# EAGLE design TempGuard (EAGLE 5.10)
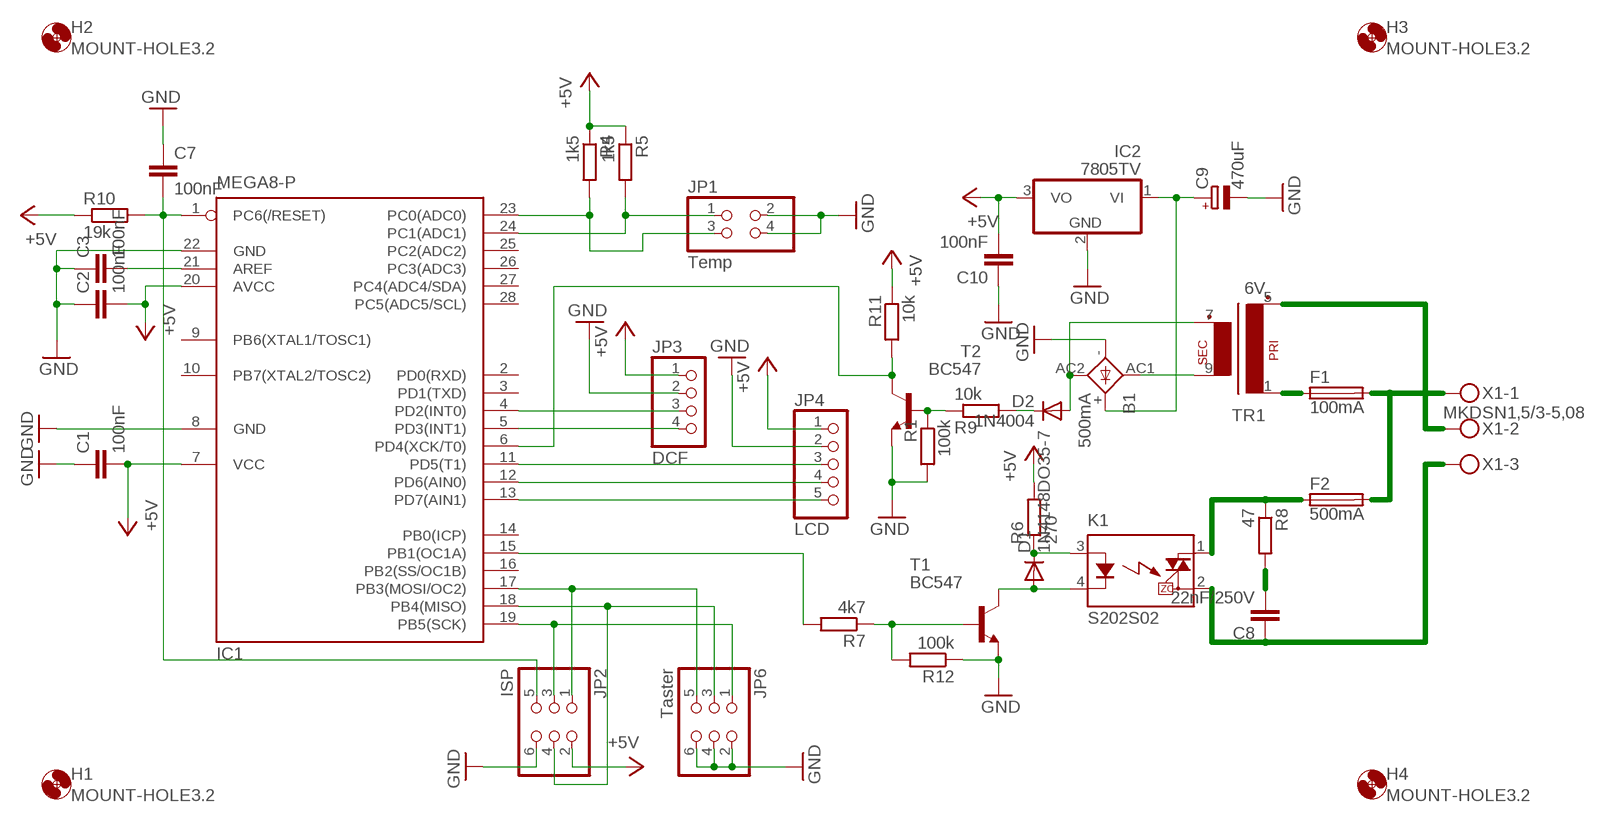
[diagram p0: schematic, sheet 1]

## Parts
B1  500mA  2KBB-R  [2KBB-R]
C1  100nF  C-EU025-025X050  [C025-025X050]
C2  100nF  C-EU025-025X050  [C025-025X050]
C3  100nF  C-EU025-025X050  [C025-025X050]
C7  100nF  C-EU025-025X050  [C025-025X050]
C8  22nF/250V  C-EU075-032X103  [C075-032X103]
C9  470uF  CPOL-EUE5-10.5  [E5-10,5]
C10  100nF  C-EU050-025X075  [C050-025X075]
D1  1N4148DO35-7  [DO35-7]
D2  1N4004  [DO41-10]
F1  100mA  SH22  [SH22]
F2  500mA  SH22  [SH22]
H1  MOUNT-HOLE3.2  [3,2]
H2  MOUNT-HOLE3.2  [3,2]
H3  MOUNT-HOLE3.2  [3,2]
H4  MOUNT-HOLE3.2  [3,2]
IC1  MEGA8-P  [DIL28-3]
IC2  7805TV  [TO220V]
JP1  Temp  PINHD-2X2  [2X02]
JP2  ISP  PINHD-2X3  [2X03]
JP3  DCF  PINHD-1X4  [1X04]
JP4  LCD  PINHD-1X5  [1X05]
JP6  Taster  PINHD-2X3  [2X03]
K1  S202S02  [S202S02]
R1  100k  R-EU_0204/7  [0204/7]
R4  1k5  R-EU_0204/7  [0204/7]
R5  1k5  R-EU_0204/7  [0204/7]
R6  270  R-EU_0204/7  [0204/7]
R7  4k7  R-EU_0204/7  [0204/7]
R8  47  R-EU_0207/10  [0207/10]
R9  10k  R-EU_0204/7  [0204/7]
R10  19k  R-EU_0204/7  [0204/7]
R11  10k  R-EU_0204/7  [0204/7]
R12  100k  R-EU_0204/7  [0204/7]
T1  BC547  [TO92]
T2  BC547  [TO92]
TR1  6V  EI30-1  [EI30-1]
X1  MKDSN1,5/3-5,08  [MKDSN1,5/3-5,08]

## Nets
+5V: C1.2 C2.2 C10.2 IC1.7(VCC) IC1.20(AVCC) IC2.3(VO) JP2.2 JP3.1 JP4.1 R4.1 R5.1 R6.2 R10.1 R11.1
GND: B1.- C1.1 C2.1 C3.1 C7.1 C9.- C10.1 IC1.8(GND) IC1.22(GND) IC2.2(GND) JP1.2 JP1.4 JP2.6 JP3.2 JP4.2 JP6.2 JP6.4 JP6.6 R1.2 R12.1 T1.1(E) T2.1(E)
N$1: C3.2 IC1.21(AREF)
N$2: IC1.5(PD3(INT1)) JP3.4
N$3: C7.2 IC1.1(PC6(/RESET)) JP2.5 R10.2
N$4: IC1.23(PC0(ADC0)) JP1.3 R4.2
N$5: IC1.24(PC1(ADC1)) JP1.1 R5.2
N$6: IC1.17(PB3(MOSI/OC2)) JP2.1 JP6.5
N$7: IC1.18(PB4(MISO)) JP2.4 JP6.3
N$8: IC1.19(PB5(SCK)) JP2.3 JP6.1
N$9: IC1.4(PD2(INT0)) JP3.3
N$10: IC1.13(PD7(AIN1)) JP4.5
N$11: IC1.11(PD5(T1)) JP4.3
N$12: IC1.12(PD6(AIN0)) JP4.4
N$13: D1.C K1.3(A) R6.1
N$14: D1.A K1.4(K) T1.3(C)
N$15: IC1.15(PB1(OC1A)) R7.2
N$16: R7.1 R12.2 T1.2(B)
N$17: C8.2 R8.2
N$18: C8.1 K1.2(DS2) X1.3
N$19: F2.1 K1.1(DS1) R8.1
N$20: F1.1 TR1.1
N$21: F1.2 F2.2 X1.1
N$22: B1.AC1 TR1.9(S4)
N$23: TR1.5(P2) X1.2
N$24: B1.AC2 D2.A TR1.7(S3)
N$25: B1.+ C9.+ IC2.1(VI)
N$26: D2.C R9.2
N$27: R1.1 R9.1 T2.2(B)
N$28: IC1.6(PD4(XCK/T0)) R11.2 T2.3(C)
Unconnected: IC1.2(PD0(RXD)) IC1.3(PD1(TXD)) IC1.9(PB6(XTAL1/TOSC1)) IC1.10(PB7(XTAL2/TOSC2)) IC1.14(PB0(ICP)) IC1.16(PB2(SS/OC1B)) IC1.25(PC2(ADC2)) IC1.26(PC3(ADC3)) IC1.27(PC4(ADC4/SDA)) IC1.28(PC5(ADC5/SCL))

## Library data of the parts
B1 = rectifier:2KBB-R: RECTIFIER grid 3 x 5 mm
C1-C3 C7 C8 C10 = rcl:C-EU: CAPACITOR, European symbol
C9 = resistor:CPOL-EU: POLARIZED CAPACITOR, European symbol
D1 = diode:1N4148: DIODE high speed (Philips)
D2 = diode:1N4004: DIODE general purpose rectifier, 1 A
F1 F2 = fuse:SH22: FUSE HOLDER CS PFP30, Schukat
H1-H4 = holes:MOUNT-HOLE: MOUNTING HOLE with drill center marker
IC1 = atmel:MEGA8-P: MICROCONTROLLER 8 Kbytes FLASH, 1 kbytes SRAM, 512 bytes EEPROM, USART, 4-channel 10 bit ADC, 2-channel 8 bit ADC Pin compatible with Atmega48, ATMega88, ATMega168 Source: avr.lbr
IC2 = linear:78*: Positive VOLTAGE REGULATOR Source: http://cache.national.com/ds/LM/LM78L05.pdf http://www.fairchildsemi.com/ds/LM/LM7805.pdf
JP1 = pinhead:PINHD-2X2: PIN HEADER
JP2 JP6 = pinhead:PINHD-2X3: PIN HEADER
JP3 = pinhead:PINHD-1X4: PIN HEADER
JP4 = pinhead:PINHD-1X5: PIN HEADER
K1 = relay:S*02S02: IT(rms) 8A, Zero Cross type SIP 4pin Triac output SSR Source: http://sharp-world.com/products/device/lineup/data/pdf/datasheet/s102s02_e.pdf
R1 R4-R12 = rcl:R-EU_: RESISTOR, European symbol
T1 T2 = transistor:BC547: NPN TRANSISTOR
TR1 = trafo:EI30-1: TRANSFORMER 1 primary winding, 1 secondary winding ERA
X1 = con-phoenix-508:MKDSN1,5/3-5,08: MKDSN 1,5/ 3-5,08 Printklemme Nennstrom: 13,5 A Nennspannung: 250 V Rastermaß: 5,08 mm Polzahl: 3 Anschlussart: Schraubanschluss Montage: Löten Anschlussrichtung Leiter/Platine: 0 ° Artikelnummer: 1729131 Source: http://eshop.phoenixcontact.com .. 1729131.pdf

## Board
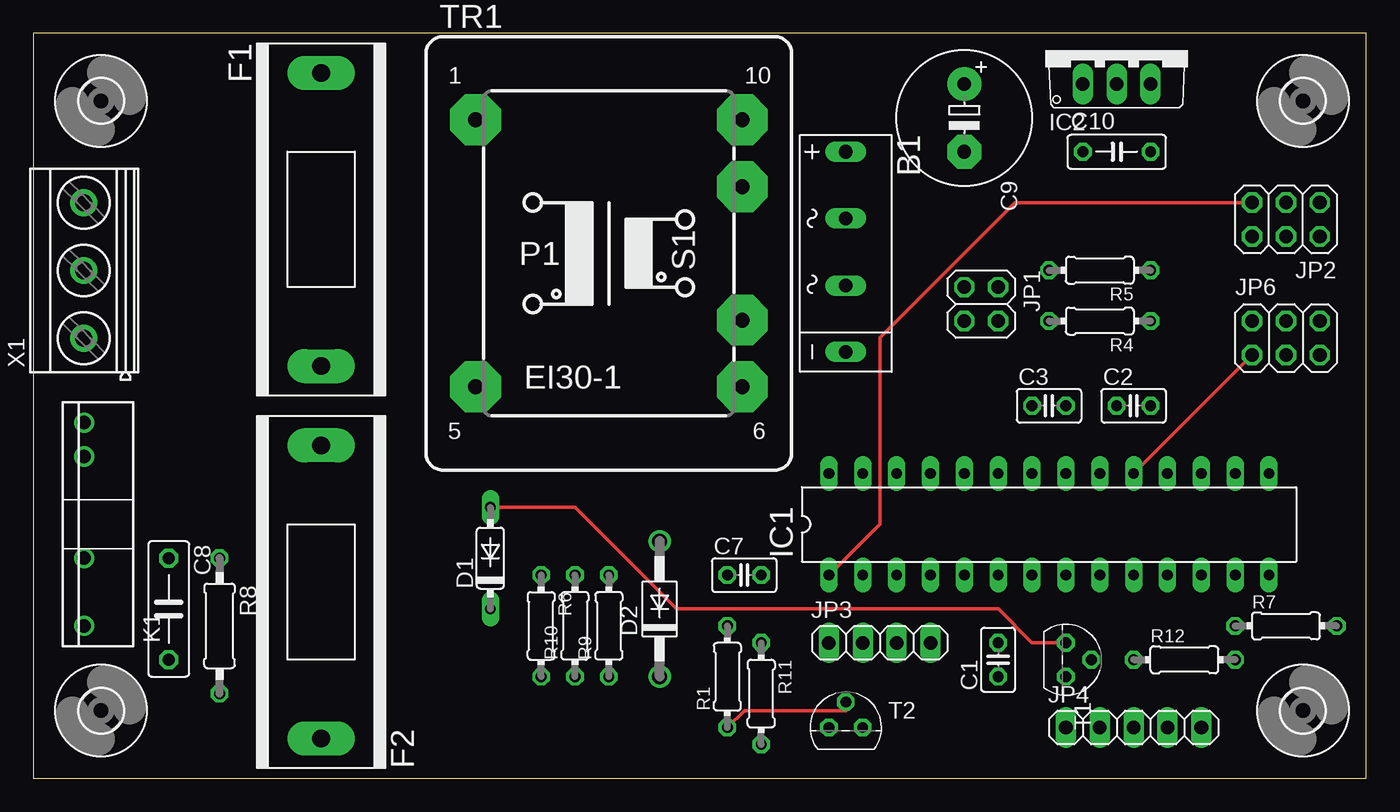
[diagram p1: board, top side]
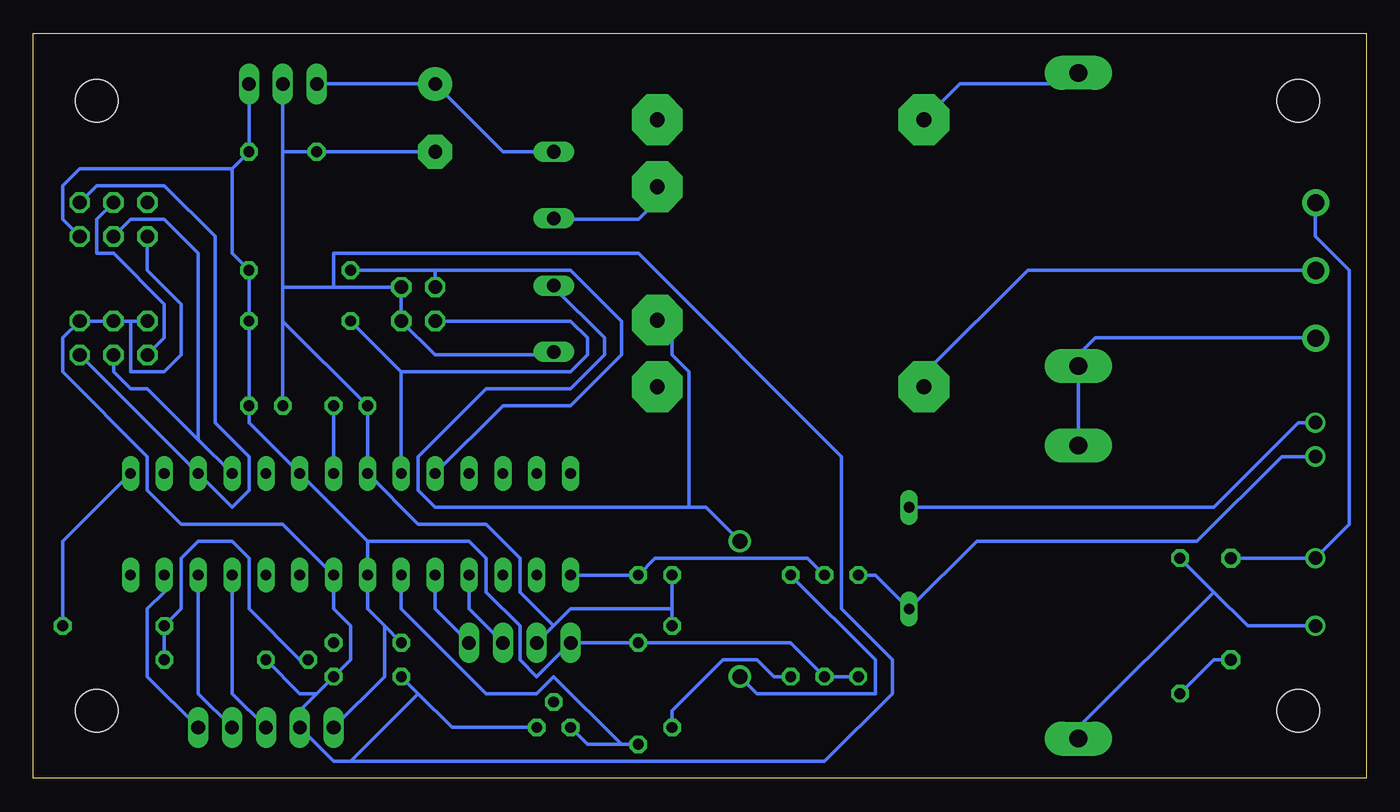
[diagram p2: board, bottom side, seen from below]

Size 100 x 55.87 mm. Coordinates in mm from the lower left corner, seen from the top.
Outline: 0,0 100,0 100,55.87 0,55.87 0,0
Copper layers (1*16): Top 0.035mm / dielectric 1.5mm / Bottom 0.035mm
Design rules "10mils": minimum track width 10mil, minimum drill 24mil, track to track 10mil, track to pad 10mil, pad to pad 10mil, via to via 10mil, smd to smd 10mil, copper to edge 40mil, drill to drill 10mil, minimum pad ring 10mil, minimum via ring 8mil, stop-mask expansion 0mil, vias tented up to drill 0mil, thermal gap 10mil

### Footprints (pad centres in the part's own frame; a part is rotated, then mirrored left to right if it is on the bottom)
2KBB-R = drill 1.016 long: + -7.62,0; - 7.391,0; AC1 -2.616,0; AC2 2.413,0
C025-025X050 = drill 0.813 octagon: 1 -1.27,0; 2 1.27,0
C075-032X103 = drill 0.914 octagon: 1 -3.81,0; 2 3.81,0
E5-10,5 = drill 1.016 pad 2.54 round: + -2.54,0 | drill 1.016 pad 2.54 octagon: - 2.54,0
C050-025X075 = drill 0.813 octagon: 1 -2.54,0; 2 2.54,0
DO35-7 = drill 0.813 long: A 3.81,0; C -3.81,0
DO41-10 = drill 1.118 round: A 5.08,0; C -5.08,0
SH22 = drill 1.321 pad 2.54 long: 1 -10.998,0; 2 10.998,0
3,2 = hole 3.2: 0,0
DIL28-3 = drill 0.813 long: 1 -16.51,-3.81; 2 -13.97,-3.81; 3 -11.43,-3.81; 4 -8.89,-3.81; 5 -6.35,-3.81; 6 -3.81,-3.81; 7 -1.27,-3.81; 8 1.27,-3.81; 9 3.81,-3.81; 10 6.35,-3.81; 11 8.89,-3.81; 12 11.43,-3.81; 13 13.97,-3.81; 14 16.51,-3.81; 15 16.51,3.81; 16 13.97,3.81; 17 11.43,3.81; 18 8.89,3.81; 19 6.35,3.81; 20 3.81,3.81; 21 1.27,3.81; 22 -1.27,3.81; 23 -3.81,3.81; 24 -6.35,3.81; 25 -8.89,3.81; 26 -11.43,3.81; 27 -13.97,3.81; 28 -16.51,3.81
TO220V = drill 1.016 long: 1 -2.54,-2.54; 2 0,-2.54; 3 2.54,-2.54
2X02 = drill 1.016 octagon: 1 -1.27,-1.27; 2 -1.27,1.27; 3 1.27,-1.27; 4 1.27,1.27
2X03 = drill 1.016 octagon: 1 -2.54,-1.27; 2 -2.54,1.27; 3 0,-1.27; 4 0,1.27; 5 2.54,-1.27; 6 2.54,1.27
1X04 = drill 1.016 long: 1 -3.81,0; 2 -1.27,0; 3 1.27,0; 4 3.81,0
1X05 = drill 1.016 long: 1 -5.08,0; 2 -2.54,0; 3 0,0; 4 2.54,0; 5 5.08,0
S202S02 = drill 1 round: 1 -7.62,0; 2 -2.54,0; 3 5.08,0; 4 7.62,0
0204/7 = drill 0.813 octagon: 1 -3.81,0; 2 3.81,0
0207/10 = drill 0.813 octagon: 1 -5.08,0; 2 5.08,0
TO92 = drill 0.813 octagon: 1 1.27,0; 2 0,1.905; 3 -1.27,0
EI30-1 = drill 1.118 pad 3.81 octagon: 1 -10.008,10.008; 5 -10.008,-10.008; 6 10.008,-10.008; 7 10.008,-5.004; 9 10.008,5.004; 10 10.008,10.008
MKDSN1,5/3-5,08 = drill 1.3 pad 2 round: 1 -7.641,0.025; 2 -2.561,0.025; 3 2.519,0.025

### Placement (x,y rotation side)
B1  60.96,39.37 270 top
C1  72.39,8.89 90 top
C2  82.55,27.94 0 top
C3  76.2,27.94 0 top
C7  53.34,15.24 0 top
C8  10.16,12.7 270 top
C9  69.85,49.53 270 top
C10  81.28,46.99 0 top
D1  34.29,16.51 90 top
D2  46.99,12.7 90 top
F1  21.59,41.91 270 top
F2  21.59,13.97 90 top
H1  95.25,50.8 0 top
H2  5.08,50.8 0 top
H3  95.25,5.08 0 top
H4  5.08,5.08 0 top
IC1  76.2,19.05 0 top
IC2  81.28,54.61 0 top
JP1  71.12,35.56 270 top
JP2  93.98,41.91 180 top
JP3  63.5,10.16 0 top
JP4  82.55,3.81 0 top
JP6  93.98,33.02 0 top
K1  3.81,19.05 90 top
R1  52.07,7.62 90 top
R4  80.01,34.29 180 top
R5  80.01,38.1 180 top
R6  38.1,11.43 270 top
R7  93.98,11.43 0 top
R8  13.97,11.43 270 top
R9  43.18,11.43 90 top
R10  40.64,11.43 90 top
R11  54.61,6.35 270 top
R12  86.36,8.89 0 top
T1  77.47,8.89 270 top
T2  60.96,3.81 0 top
TR1  43.18,39.37 0 top
X1  3.81,40.64 90 top

### Tracks (layer width: path | path; a pad name or v marks a point on that pad's centre or on a via)
+5V
  Bottom 0.254: IC2.3 C10.2 85.09,45.72 | JP2.2 97.79,41.91 97.79,44.45 96.52,45.72 85.09,45.72 | R6.2 R10.1 43.18,10.16 R11.1 JP3.1 62.23,7.62 63.5,8.89 63.5,11.43 66.04,13.97 66.04,16.51 67.31,17.78 74.93,17.78 | 73.66,11.43 74.93,12.7 IC1.7 74.93,17.78 | 73.66,11.43 C1.2 | JP4.1 73.66,7.62 73.66,11.43 | 74.93,17.78 IC1.20 83.82,26.67 C2.2 R4.1 R5.1 85.09,39.37 85.09,45.72
GND
  Bottom 0.254: B1.- 60.96,31.75 69.85,31.75 JP1.4 JP1.2 77.47,36.83 | 52.07,12.7 C7.1 | 52.07,12.7 R1.2 | 60.96,11.43 59.69,12.7 52.07,12.7 | 60.96,11.43 JP3.2 | C9.- C10.1 81.28,46.99 | 81.28,46.99 IC2.2 | 81.28,36.83 81.28,46.99 | 81.28,36.83 81.28,34.29 | 81.28,34.29 C2.1 | 81.28,34.29 C3.1 IC1.22 71.12,19.05 66.04,19.05 63.5,16.51 63.5,13.97 60.96,11.43 | 77.47,36.83 81.28,36.83 | 92.71,34.29 JP6.4 JP6.6 97.79,33.02 97.79,30.48 91.44,24.13 91.44,21.59 88.9,19.05 81.28,19.05 IC1.8 77.47,12.7 76.2,11.43 76.2,8.89 T1.1 78.74,6.35 | 92.71,34.29 JP6.2 | JP2.6 91.44,38.1 88.9,35.56 88.9,31.75 90.17,30.48 92.71,30.48 92.71,34.29 | T2.1 68.58,3.81 71.12,6.35 | 71.12,6.35 C1.1 | 78.74,6.35 80.01,5.08 JP4.2 77.47,1.27 76.2,1.27 | R12.1 80.01,6.35 78.74,6.35 | 76.2,1.27 71.12,6.35 | 77.47,36.83 77.47,39.37 54.61,39.37 39.37,24.13 39.37,12.7 35.56,8.89 35.56,6.35 40.64,1.27 76.2,1.27
N$1
  Bottom 0.254: IC1.21 C3.2
N$2
  Bottom 0.254: IC1.5 69.85,12.7 JP3.4
N$3
  Top 0.254: JP2.5 73.66,43.18 63.5,33.02 63.5,19.05 IC1.1
  Bottom 0.254: R10.2 41.91,16.51 53.34,16.51 C7.2 IC1.1
N$4
  Bottom 0.254: 72.39,30.48 IC1.23 | 72.39,30.48 R4.2 | JP1.3 59.69,34.29 58.42,33.02 58.42,31.75 59.69,30.48 72.39,30.48
N$5
  Bottom 0.254: IC1.24 64.77,27.94 59.69,27.94 55.88,31.75 55.88,34.29 59.69,38.1 69.85,38.1 | 69.85,38.1 R5.2 | 69.85,38.1 JP1.1
N$6
  Bottom 0.254: JP6.5 IC1.17 85.09,20.32 83.82,21.59 83.82,24.13 86.36,26.67 86.36,40.64 90.17,44.45 95.25,44.45 JP2.1
N$7
  Bottom 0.254: 87.63,25.4 91.44,29.21 92.71,29.21 93.98,30.48 JP6.3 | IC1.18 87.63,25.4 | JP2.4 92.71,41.91 90.17,41.91 87.63,39.37 87.63,25.4
N$8
  Top 0.254: IC1.19 JP6.1
  Bottom 0.254: JP6.1 90.17,33.02 90.17,35.56 93.98,39.37 95.25,39.37 95.25,41.91 JP2.3
N$9
  Bottom 0.254: IC1.4 67.31,12.7 JP3.3
N$10
  Bottom 0.254: IC1.13 90.17,13.97 91.44,12.7 91.44,7.62 JP4.5
N$11
  Bottom 0.254: IC1.11 85.09,6.35 JP4.3
N$12
  Bottom 0.254: IC1.12 87.63,6.35 JP4.4
N$13
  Bottom 0.254: R6.1 36.83,15.24 D1.C 29.21,17.78 12.7,17.78 6.35,24.13 K1.3
N$14
  Top 0.254: T1.3 74.93,10.16 72.39,12.7 48.26,12.7 40.64,20.32 D1.A
  Bottom 0.254: D1.A 11.43,20.32 5.08,26.67 K1.4
N$15
  Bottom 0.254: R7.2 97.79,17.78 IC1.15
N$16
  Bottom 0.254: T1.2 80.01,8.89 83.82,12.7 83.82,16.51 85.09,17.78 87.63,17.78 88.9,16.51 88.9,12.7 R7.1 R12.2
N$17
  Bottom 0.254: R8.2 11.43,8.89 C8.2
N$18
  Bottom 0.254: C8.1 K1.2 1.27,19.05 1.27,38.1 3.81,40.64 3.81,43.18 X1.3
N$19
  Bottom 0.254: 11.43,13.97 8.89,11.43 K1.1 | 11.43,13.97 R8.1 | 11.43,13.97 21.59,3.81 F2.1
N$20
  Bottom 0.254: F1.1 21.59,52.07 30.48,52.07 TR1.1
N$21
  Bottom 0.254: X1.1 3.81,33.02 20.32,33.02 21.59,31.75 F1.2 F2.2
N$22
  Bottom 0.254: B1.AC1 60.96,41.91 54.61,41.91 53.34,43.18 TR1.9
N$23
  Bottom 0.254: X1.2 3.81,38.1 25.4,38.1 33.02,30.48 TR1.5
N$24
  Bottom 0.254: 50.8,20.32 49.53,20.32 D2.A | 50.8,20.32 69.85,20.32 71.12,21.59 71.12,24.13 66.04,29.21 59.69,29.21 57.15,31.75 57.15,33.02 60.96,36.83 B1.AC2 | 50.8,20.32 50.8,30.48 52.07,31.75 52.07,34.29 TR1.7
N$25
  Bottom 0.254: B1.+ 64.77,46.99 C9.+ IC2.1
N$26
  Bottom 0.254: R9.2 36.83,8.89 36.83,6.35 45.72,6.35 D2.C
N$27
  Top 0.254: R1.1 53.34,5.08 60.96,5.08 T2.2
  Bottom 0.254: R9.1 44.45,7.62 45.72,8.89 48.26,8.89 52.07,5.08 R1.1
N$28
  Bottom 0.254: 55.88,2.54 58.42,2.54 T2.3 | R11.2 55.88,2.54 | IC1.6 72.39,12.7 66.04,6.35 62.23,6.35 60.96,7.62 55.88,2.54